# Altium project BLE_Motion_Tracker_V2.PrjPcb
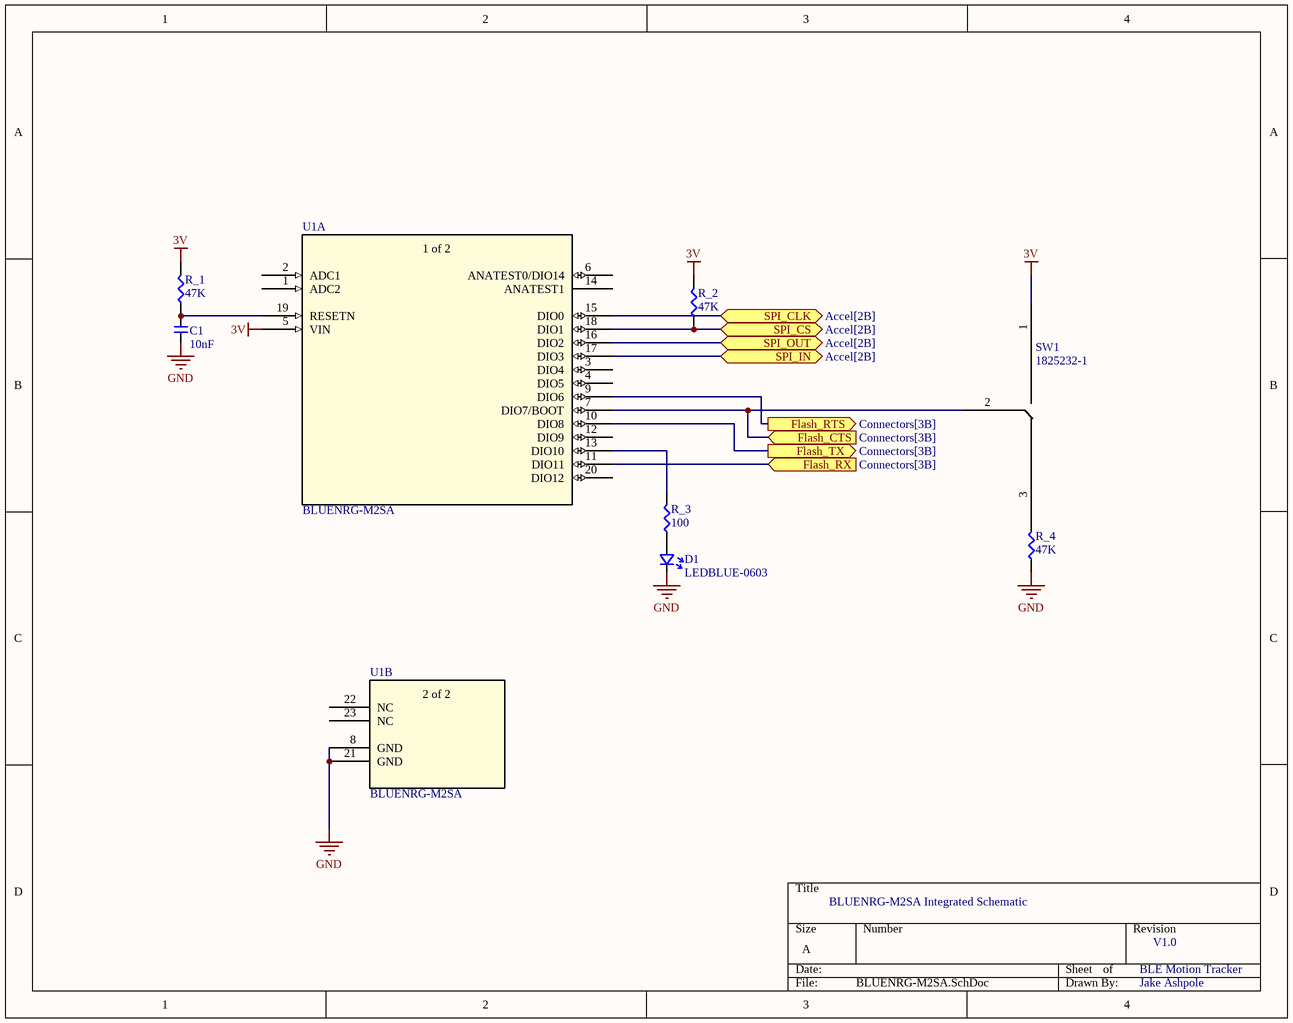
[diagram p0: BLUENRG-M2SA.SchDoc]
2 sheets, 11 parts. Net scope: flat (ports and power ports of the same name join across sheets).
Board file: BLE_Motion_Tracker_PCB.PcbDoc
Sheets:
  BLUENRG-M2SA.SchDoc
  Connectors.SchDoc

## Sheet BLUENRG-M2SA.SchDoc
size A; SheetNumber: 1; SheetTotal: 3

### Parts
C1  10nF  [CAP-0603]
D1  LEDBLUE-0603  [LEDBLUE-0603]
R_1  47K  [RES-0603]
R_2  47K  [RES-0603]
R_3  100  [RES-0603]
R_4  47K  [RES-0603]
SW1  1825232-1  [1825232-1_TEC]
U1  BLUENRG-M2SA  [BLUENRG-2M_STM]  (parts A,B of 3)

### Ports
Flash_CTS (in, see Connectors[3B]), Flash_RTS (out, see Connectors[3B]), Flash_RX (in, see Connectors[3B]), Flash_TX (out, see Connectors[3B]), SPI_CLK (bidir, see Accel[2B]), SPI_CS (bidir, see Accel[2B]), SPI_IN (bidir, see Accel[2B]), SPI_OUT (bidir, see Accel[2B])

### Nets
3V: R_1.2 R_2.2 SW1.1 U1.5(VIN)
GND: C1.1 D1.K R_4.1 U1.8(GND) U1.21(GND)
NetC1_2: C1.2 R_1.1 U1.19(RESETN)
NetD1_A: D1.A R_3.1
NetJ1_2: U1.9(DIO6) ; port Flash_RTS
NetJ1_4: U1.11(DIO11) ; port Flash_RX
NetJ1_5: U1.10(DIO8) ; port Flash_TX
NetJ1_6: SW1.2 U1.7(DIO7/BOOT) ; port Flash_CTS
NetR_2_1: R_2.1 U1.18(DIO1) ; port SPI_CS
NetR_3_2: R_3.2 U1.13(DIO10)
NetR_4_2: R_4.2 SW1.3
NetU1_15: U1.15(DIO0) ; port SPI_CLK
NetU1_16: U1.16(DIO2) ; port SPI_OUT
NetU1_17: U1.17(DIO3) ; port SPI_IN

Not connected (* = marked no-connect by the designer): U1 1(ADC2) 2(ADC1) 3(DIO4) 4(DIO5) 6(ANATEST0/DIO14) 12(DIO9) 14(ANATEST1) 20(DIO12) 22(NC) 23(NC)

### Notes on the sheet
- BLUENRG-M2SA Integrated Schematic
- BLE Motion Tracker
- V1.0
- Jake Ashpole
- (in symbol BLUENRG-M2SA, part A) 1 of 2
- (in symbol BLUENRG-M2SA, part B) 2 of 2

### Library data of the parts
C1 = CMP-009-000303-1: Source: ife19_Elec_Library.SchLib; Design Item ID: CAP-0603
D1 = CMP-009-000191-1: Design Item ID: LEDBLUE-0603; Source: ife19_Elec_Library.SchLib
R_1-R_4 = CMP-014-000032-1: Source: ife19_Elec_Library.SchLib; Design Item ID: RES-0603
SW1 = 1825232-1: https://www.mouser.com/ProductDetail/655-1825232-1; Mfr_Name: TE Connectivity; RefDes: RefDes; Type: Type
U1 = BLUENRG-M2SA: https://www.mouser.com/ProductDetail/STMicroelectronics/BLUENRG-M2SA?qs=%252B6g0mu59x7K3hjyySj690A%3D%3D; Mfr_Name: STMicroelectronics; RefDes: RefDes; Type: Type

## Sheet Connectors.SchDoc
size A; SheetNumber: 3; SheetTotal: 3
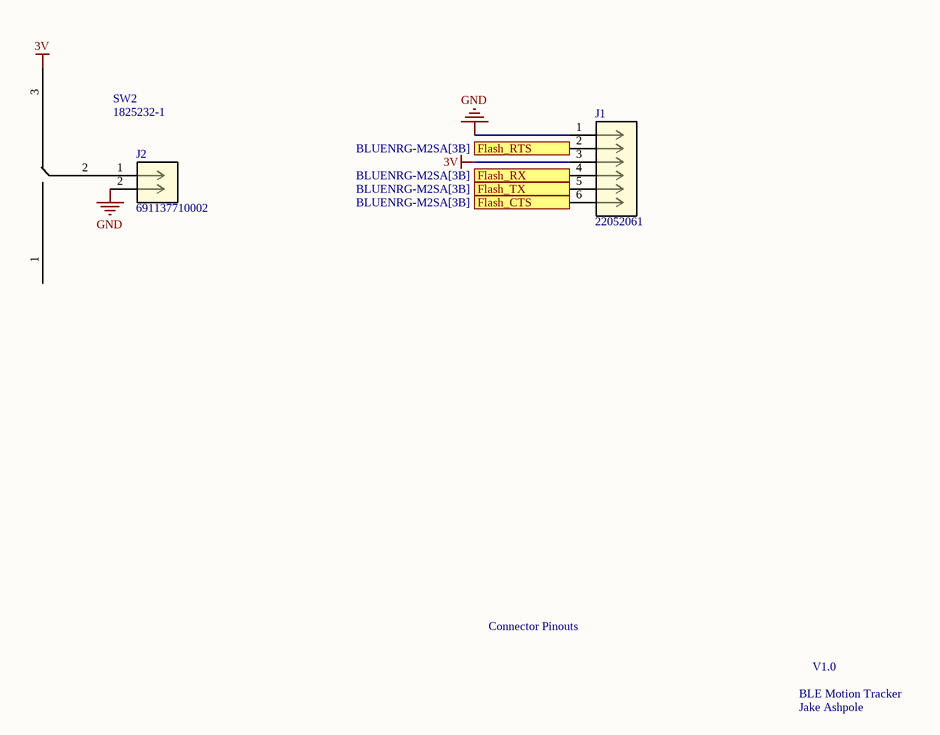
[diagram p1: Connectors.SchDoc]

### Parts
J1  22052061  [CONN_22-05-2061_MOL]
J2  691137710002  [CONN2_710002_WRE]
SW2  1825232-1  [1825232-1_TEC]

### Ports
Flash_CTS (out, see BLUENRG-M2SA[3B]), Flash_RTS (in, see BLUENRG-M2SA[3B]), Flash_RX (out, see BLUENRG-M2SA[3B]), Flash_TX (in, see BLUENRG-M2SA[3B])

### Nets
3V: J1.3 SW2.3
GND: J1.1 J2.2
NetJ1_2: J1.2 ; port Flash_RTS
NetJ1_4: J1.4 ; port Flash_RX
NetJ1_5: J1.5 ; port Flash_TX
NetJ1_6: J1.6 ; port Flash_CTS
NetJ2_1: J2.1 SW2.2

Not connected (* = marked no-connect by the designer): SW2 1

### Notes on the sheet
- Connector Pinouts
- BLE Motion Tracker
- V1.0
- Jake Ashpole

### Library data of the parts
J1 = 22052061: FTDI UART Flashing connector -- https://www.mouser.com/ProductDetail/Molex/22-05-2061?qs=th8CuLdcYnn%252BP%252BN0RJkmpg%3D%3D; Mfr_Name: Molex Connector Corporation; RefDes: RefDes; Type: Type
J2 = 691137710002: Connector to provide Battery voltage -- https://www.mouser.com/ProductDetail/Wurth-Elektronik/691137910002?qs=sPbYRqrBIVkdp9j8kfiV1w%3D%3D; Mfr_Name: Wurth Electronics; RefDes: RefDes; Type: Type
SW2 = 1825232-1: as SW1 on sheet BLUENRG-M2SA; RefDes: RefDes; Type: Type

## Nets that join several sheets
3V: BLUENRG-M2SA (R_1.2 R_2.2 SW1.1 U1.5), Connectors (J1.3 SW2.3)
GND: BLUENRG-M2SA (5 pins), Connectors (J1.1 J2.2)
NetJ1_2: BLUENRG-M2SA (U1.9), Connectors (J1.2)
NetJ1_4: BLUENRG-M2SA (U1.11), Connectors (J1.4)
NetJ1_5: BLUENRG-M2SA (U1.10), Connectors (J1.5)
NetJ1_6: BLUENRG-M2SA (SW1.2 U1.7), Connectors (J1.6)